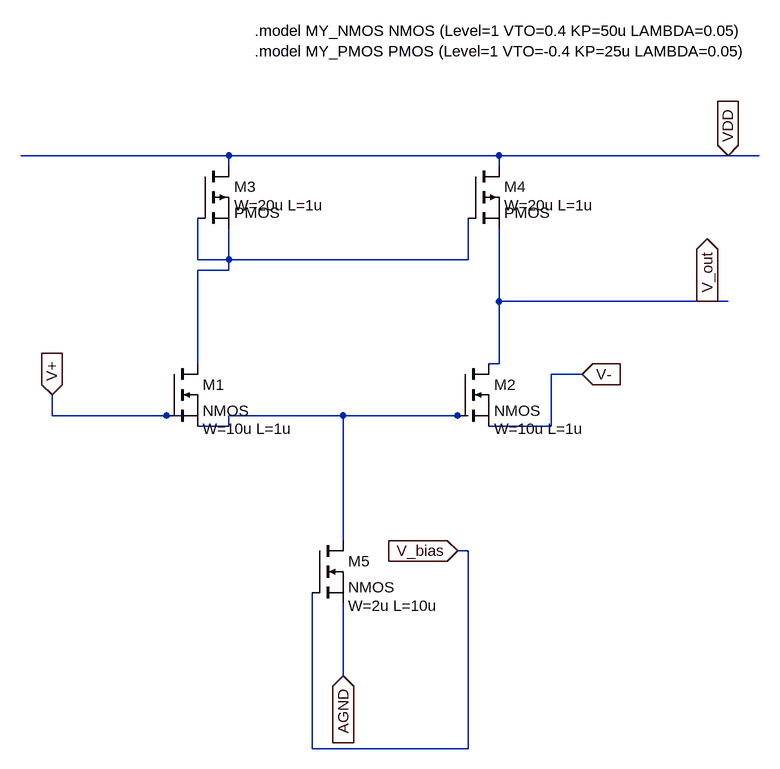
[diagram p0: schematic ota_core.asc]
ota_core.asc, the LTspice schematic file:
Version 4.1
SHEET 1 948 736
WIRE 96 -192 -224 -192
WIRE 512 -192 96 -192
WIRE 864 -192 512 -192
WIRE 912 -192 864 -192
WIRE 96 -176 96 -192
WIRE 512 -176 512 -192
WIRE 48 -32 48 -96
WIRE 96 -32 96 -80
WIRE 96 -32 48 -32
WIRE 464 -32 464 -96
WIRE 464 -32 96 -32
WIRE 96 -16 96 -32
WIRE 96 -16 48 -16
WIRE 512 32 512 -80
WIRE 832 32 512 32
WIRE 864 32 832 32
WIRE 48 128 48 -16
WIRE 512 128 512 32
WIRE 512 128 496 128
WIRE 640 144 592 144
WIRE -176 208 -176 176
WIRE 0 208 -176 208
WIRE 48 208 0 208
WIRE 272 208 96 208
WIRE 448 208 272 208
WIRE 464 208 448 208
WIRE 96 224 96 208
WIRE 96 224 48 224
WIRE 592 224 592 144
WIRE 592 224 496 224
WIRE 272 400 272 208
WIRE 464 416 448 416
WIRE 272 608 272 496
WIRE 224 720 224 480
WIRE 464 720 464 416
WIRE 464 720 224 720
FLAG 864 -192 VDD
IOPIN 864 -192 In
FLAG -176 176 V+
IOPIN -176 176 In
FLAG 640 144 V-
IOPIN 640 144 In
FLAG 448 416 V_bias
IOPIN 448 416 In
FLAG 832 32 V_out
IOPIN 832 32 Out
FLAG 272 608 AGND
IOPIN 272 608 In
SYMBOL pmos 48 -176 R0
WINDOW 123 56 60 Left 2
SYMATTR InstName M3
SYMATTR Value2 W=20u L=1u
SYMBOL pmos 464 -176 R0
WINDOW 123 56 60 Left 2
SYMATTR InstName M4
SYMATTR Value2 W=20u L=1u
SYMBOL nmos 0 128 R0
WINDOW 123 56 100 Left 2
SYMATTR InstName M1
SYMATTR Value2 W=10u L=1u
SYMBOL nmos 448 128 R0
WINDOW 123 56 100 Left 2
SYMATTR InstName M2
SYMATTR Value2 W=10u L=1u
SYMBOL nmos 224 400 R0
WINDOW 123 56 100 Left 2
SYMATTR InstName M5
SYMATTR Value2 W=2u L=10u
TEXT 136 -384 Left 2 !.model MY_NMOS NMOS (Level=1 VTO=0.4 KP=50u LAMBDA=0.05)\n.model MY_PMOS PMOS (Level=1 VTO=-0.4 KP=25u LAMBDA=0.05)

The netlist it stands for:
* ota_core.asc
M3 VDD N001 N001 N001 PMOS W=20u L=1u
M4 VDD N001 V_out V_out PMOS W=20u L=1u
M1 N001 V+ N002 N002 NMOS W=10u L=1u
M2 V_out N002 V- V- NMOS W=10u L=1u
M5 N002 V_bias AGND AGND NMOS W=2u L=10u
.model NMOS NMOS
.model PMOS PMOS
.lib standard.mos
.model MY_NMOS NMOS (Level=1 VTO=0.4 KP=50u LAMBDA=0.05)
.model MY_PMOS PMOS (Level=1 VTO=-0.4 KP=25u LAMBDA=0.05)
.backanno
.end